# Altium schematic sheet KeyMatrix.SchDoc
size A3; SheetNumber: 2; SheetTotal: 2
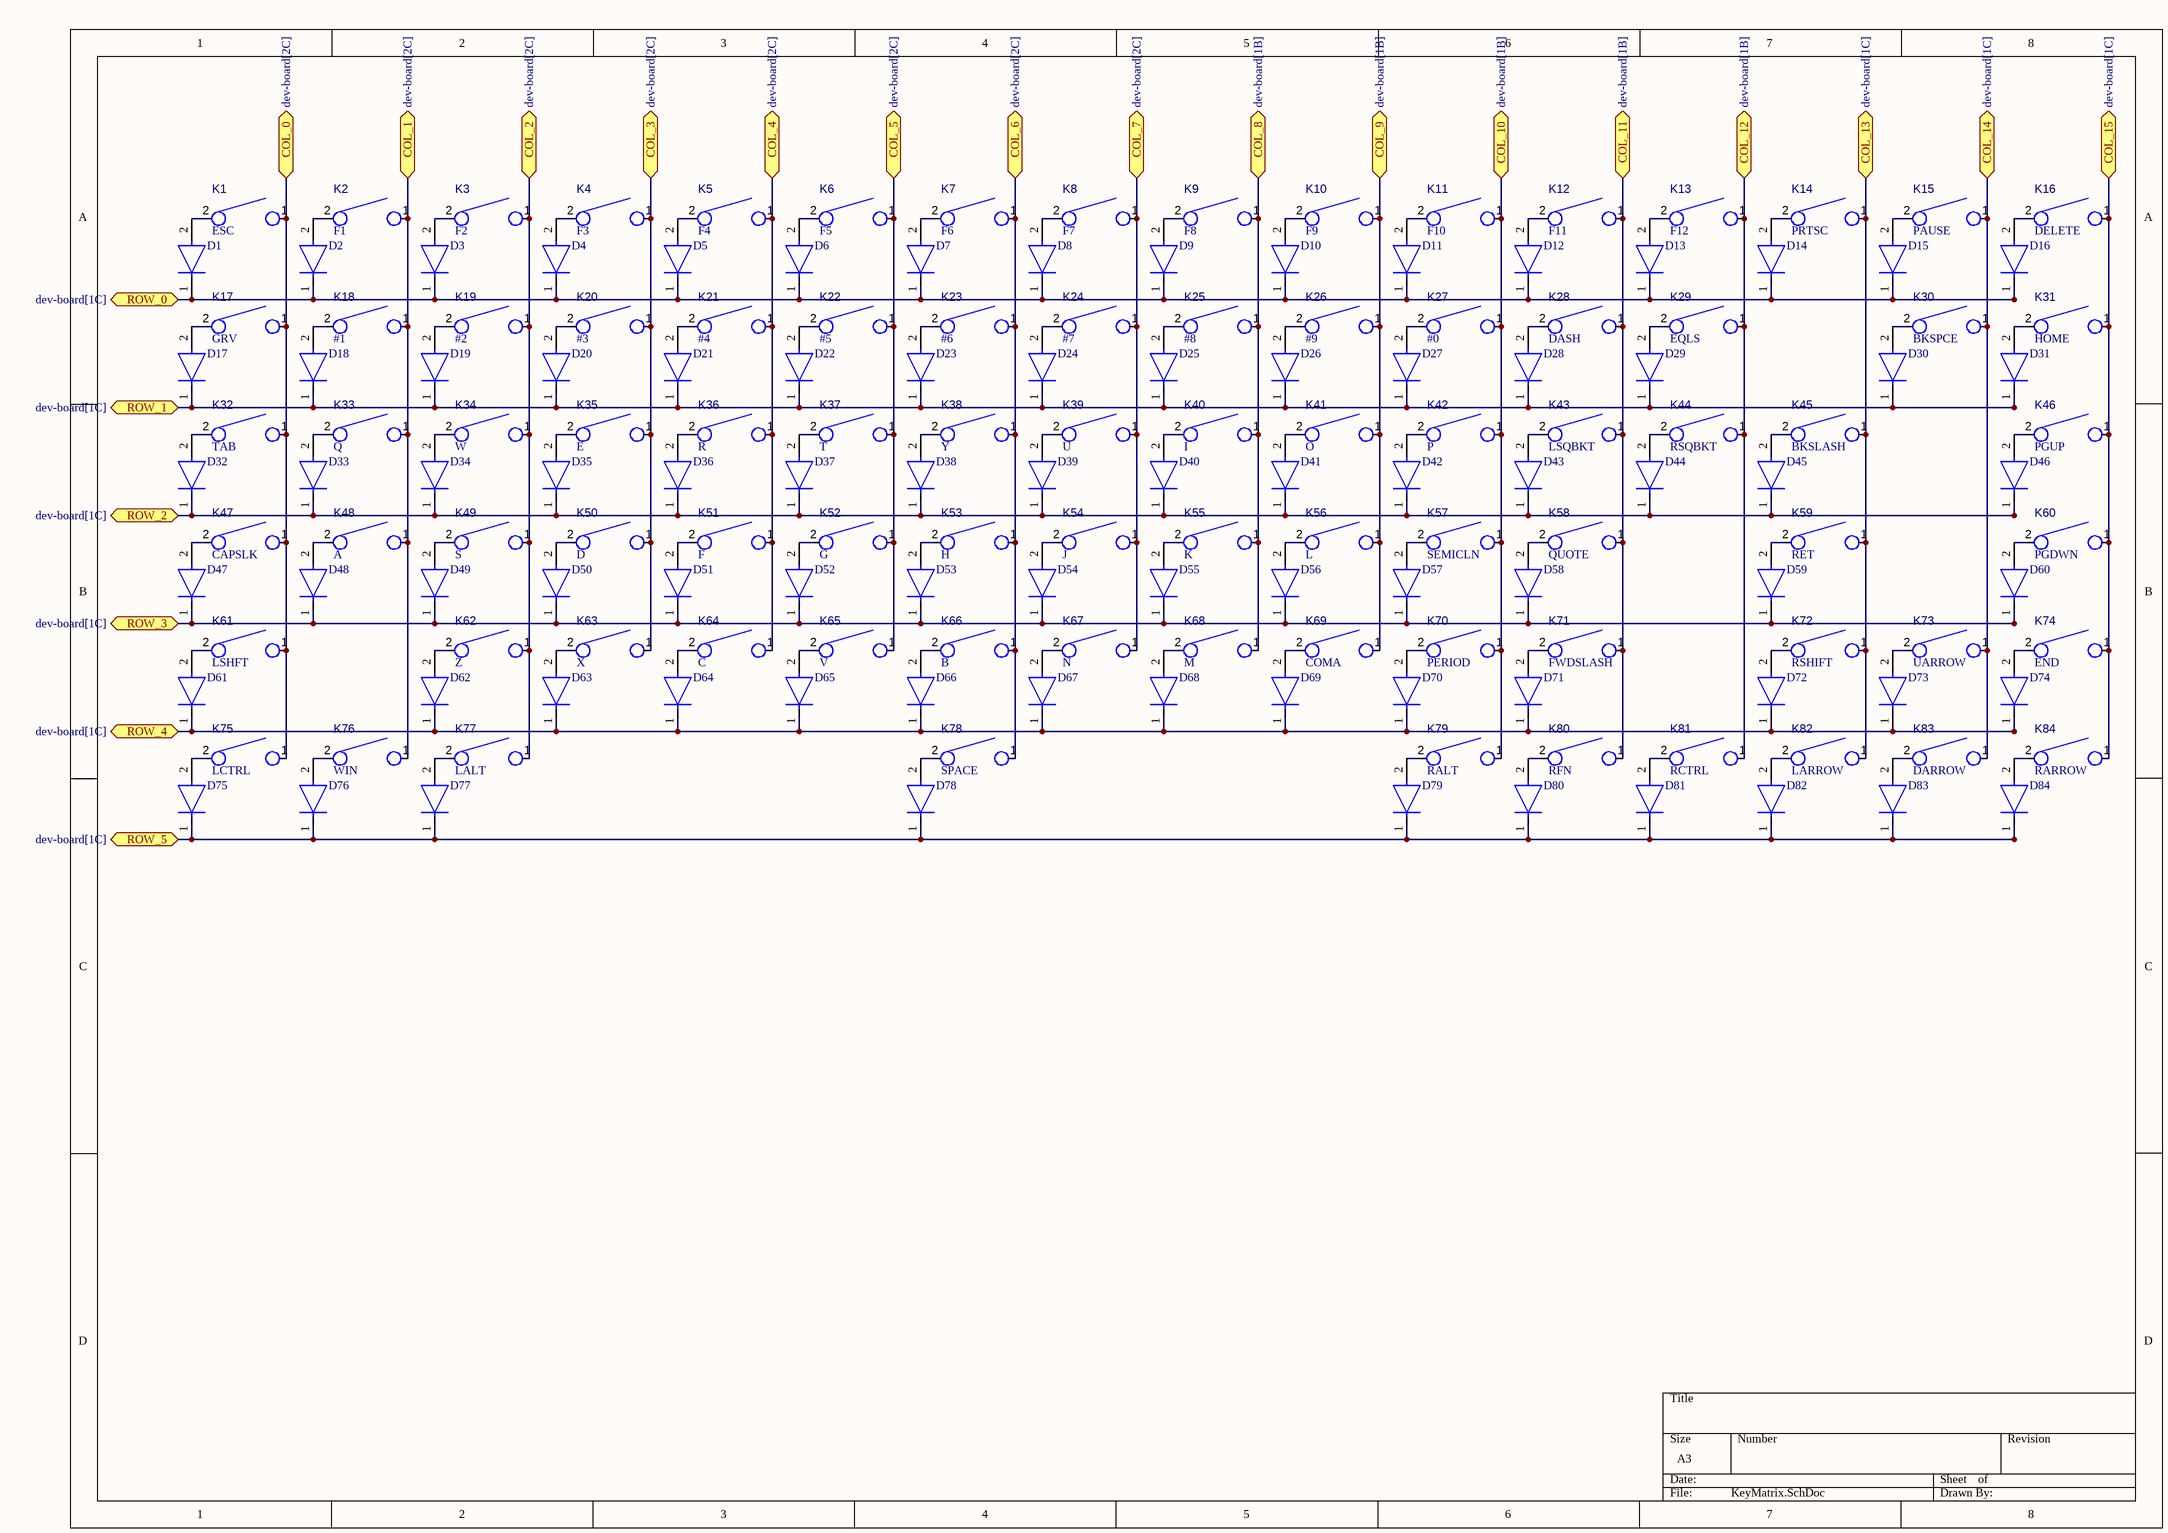
[diagram p0: KeyMatrix.SchDoc]

## Parts
D1  (no value)  [FP-SOD-123-IPC_A]
D2  (no value)  [FP-SOD-123-IPC_A]
D3  (no value)  [FP-SOD-123-IPC_A]
D4  (no value)  [FP-SOD-123-IPC_A]
D5  (no value)  [FP-SOD-123-IPC_A]
D6  (no value)  [FP-SOD-123-IPC_A]
D7  (no value)  [FP-SOD-123-IPC_A]
D8  (no value)  [FP-SOD-123-IPC_A]
D9  (no value)  [FP-SOD-123-IPC_A]
D10  (no value)  [FP-SOD-123-IPC_A]
D11  (no value)  [FP-SOD-123-IPC_A]
D12  (no value)  [FP-SOD-123-IPC_A]
D13  (no value)  [FP-SOD-123-IPC_A]
D14  (no value)  [FP-SOD-123-IPC_A]
D15  (no value)  [FP-SOD-123-IPC_A]
D16  (no value)  [FP-SOD-123-IPC_A]
D17  (no value)  [FP-SOD-123-IPC_A]
D18  (no value)  [FP-SOD-123-IPC_A]
D19  (no value)  [FP-SOD-123-IPC_A]
D20  (no value)  [FP-SOD-123-IPC_A]
D21  (no value)  [FP-SOD-123-IPC_A]
D22  (no value)  [FP-SOD-123-IPC_A]
D23  (no value)  [FP-SOD-123-IPC_A]
D24  (no value)  [FP-SOD-123-IPC_A]
D25  (no value)  [FP-SOD-123-IPC_A]
D26  (no value)  [FP-SOD-123-IPC_A]
D27  (no value)  [FP-SOD-123-IPC_A]
D28  (no value)  [FP-SOD-123-IPC_A]
D29  (no value)  [FP-SOD-123-IPC_A]
D30  (no value)  [FP-SOD-123-IPC_A]
D31  (no value)  [FP-SOD-123-IPC_A]
D32  (no value)  [FP-SOD-123-IPC_A]
D33  (no value)  [FP-SOD-123-IPC_A]
D34  (no value)  [FP-SOD-123-IPC_A]
D35  (no value)  [FP-SOD-123-IPC_A]
D36  (no value)  [FP-SOD-123-IPC_A]
D37  (no value)  [FP-SOD-123-IPC_A]
D38  (no value)  [FP-SOD-123-IPC_A]
D39  (no value)  [FP-SOD-123-IPC_A]
D40  (no value)  [FP-SOD-123-IPC_A]
D41  (no value)  [FP-SOD-123-IPC_A]
D42  (no value)  [FP-SOD-123-IPC_A]
D43  (no value)  [FP-SOD-123-IPC_A]
D44  (no value)  [FP-SOD-123-IPC_A]
D45  (no value)  [FP-SOD-123-IPC_A]
D46  (no value)  [FP-SOD-123-IPC_A]
D47  (no value)  [FP-SOD-123-IPC_A]
D48  (no value)  [FP-SOD-123-IPC_A]
D49  (no value)  [FP-SOD-123-IPC_A]
D50  (no value)  [FP-SOD-123-IPC_A]
D51  (no value)  [FP-SOD-123-IPC_A]
D52  (no value)  [FP-SOD-123-IPC_A]
D53  (no value)  [FP-SOD-123-IPC_A]
D54  (no value)  [FP-SOD-123-IPC_A]
D55  (no value)  [FP-SOD-123-IPC_A]
D56  (no value)  [FP-SOD-123-IPC_A]
D57  (no value)  [FP-SOD-123-IPC_A]
D58  (no value)  [FP-SOD-123-IPC_A]
D59  (no value)  [FP-SOD-123-IPC_A]
D60  (no value)  [FP-SOD-123-IPC_A]
D61  (no value)  [FP-SOD-123-IPC_A]
D62  (no value)  [FP-SOD-123-IPC_A]
D63  (no value)  [FP-SOD-123-IPC_A]
D64  (no value)  [FP-SOD-123-IPC_A]
D65  (no value)  [FP-SOD-123-IPC_A]
D66  (no value)  [FP-SOD-123-IPC_A]
D67  (no value)  [FP-SOD-123-IPC_A]
D68  (no value)  [FP-SOD-123-IPC_A]
D69  (no value)  [FP-SOD-123-IPC_A]
D70  (no value)  [FP-SOD-123-IPC_A]
D71  (no value)  [FP-SOD-123-IPC_A]
D72  (no value)  [FP-SOD-123-IPC_A]
D73  (no value)  [FP-SOD-123-IPC_A]
D74  (no value)  [FP-SOD-123-IPC_A]
D75  (no value)  [FP-SOD-123-IPC_A]
D76  (no value)  [FP-SOD-123-IPC_A]
D77  (no value)  [FP-SOD-123-IPC_A]
D78  (no value)  [FP-SOD-123-IPC_A]
D79  (no value)  [FP-SOD-123-IPC_A]
D80  (no value)  [FP-SOD-123-IPC_A]
D81  (no value)  [FP-SOD-123-IPC_A]
D82  (no value)  [FP-SOD-123-IPC_A]
D83  (no value)  [FP-SOD-123-IPC_A]
D84  (no value)  [FP-SOD-123-IPC_A]
K1  ESC  [Mx_Alps_100]
K2  F1  [Mx_Alps_100]
K3  F2  [Mx_Alps_100]
K4  F3  [Mx_Alps_100]
K5  F4  [Mx_Alps_100]
K6  F5  [Mx_Alps_100]
K7  F6  [Mx_Alps_100]
K8  F7  [Mx_Alps_100]
K9  F8  [Mx_Alps_100]
K10  F9  [Mx_Alps_100]
K11  F10  [Mx_Alps_100]
K12  F11  [Mx_Alps_100]
K13  F12  [Mx_Alps_100]
K14  PRTSC  [Mx_Alps_100]
K15  PAUSE  [Mx_Alps_100]
K16  DELETE  [Mx_Alps_100]
K17  GRV  [Mx_Alps_100]
K18  #1  [Mx_Alps_100]
K19  #2  [Mx_Alps_100]
K20  #3  [Mx_Alps_100]
K21  #4  [Mx_Alps_100]
K22  #5  [Mx_Alps_100]
K23  #6  [Mx_Alps_100]
K24  #7  [Mx_Alps_100]
K25  #8  [Mx_Alps_100]
K26  #9  [Mx_Alps_100]
K27  #0  [Mx_Alps_100]
K28  DASH  [Mx_Alps_100]
K29  EQLS  [Mx_Alps_100]
K30  BKSPCE  [Mx_Alps_200]
K31  HOME  [Mx_Alps_100]
K32  TAB  [Mx_Alps_150]
K33  Q  [Mx_Alps_100]
K34  W  [Mx_Alps_100]
K35  E  [Mx_Alps_100]
K36  R  [Mx_Alps_100]
K37  T  [Mx_Alps_100]
K38  Y  [Mx_Alps_100]
K39  U  [Mx_Alps_100]
K40  I  [Mx_Alps_100]
K41  O  [Mx_Alps_100]
K42  P  [Mx_Alps_100]
K43  LSQBKT  [Mx_Alps_100]
K44  RSQBKT  [Mx_Alps_100]
K45  BKSLASH  [Mx_Alps_150]
K46  PGUP  [Mx_Alps_100]
K47  CAPSLK  [Mx_Alps_175]
K48  A  [Mx_Alps_100]
K49  S  [Mx_Alps_100]
K50  D  [Mx_Alps_100]
K51  F  [Mx_Alps_100]
K52  G  [Mx_Alps_100]
K53  H  [Mx_Alps_100]
K54  J  [Mx_Alps_100]
K55  K  [Mx_Alps_100]
K56  L  [Mx_Alps_100]
K57  SEMICLN  [Mx_Alps_100]
K58  QUOTE  [Mx_Alps_100]
K59  RET  [Mx_Alps_225]
K60  PGDWN  [Mx_Alps_100]
K61  LSHFT  [Mx_Alps_225]
K62  Z  [Mx_Alps_100]
K63  X  [Mx_Alps_100]
K64  C  [Mx_Alps_100]
K65  V  [Mx_Alps_100]
K66  B  [Mx_Alps_100]
K67  N  [Mx_Alps_100]
K68  M  [Mx_Alps_100]
K69  COMA  [Mx_Alps_100]
K70  PERIOD  [Mx_Alps_100]
K71  FWDSLASH  [Mx_Alps_100]
K72  RSHIFT  [Mx_Alps_175]
K73  UARROW  [Mx_Alps_100]
K74  END  [Mx_Alps_100]
K75  LCTRL  [Mx_Alps_125]
K76  WIN  [Mx_Alps_125]
K77  LALT  [Mx_Alps_125]
K78  SPACE  [Mx_Alps_625]
K79  RALT  [Mx_Alps_100]
K80  RFN  [Mx_Alps_100]
K81  RCTRL  [Mx_Alps_100]
K82  LARROW  [Mx_Alps_100]
K83  DARROW  [Mx_Alps_100]
K84  RARROW  [Mx_Alps_100]

## Ports
COL_0 (bidir, see dev-board[2C]), COL_1 (bidir, see dev-board[2C]), COL_2 (bidir, see dev-board[2C]), COL_3 (bidir, see dev-board[2C]), COL_4 (bidir, see dev-board[2C]), COL_5 (bidir, see dev-board[2C]), COL_6 (bidir, see dev-board[2C]), COL_7 (bidir, see dev-board[2C]), COL_8 (bidir, see dev-board[1B]), COL_9 (bidir, see dev-board[1B]), COL_10 (bidir, see dev-board[1B]), COL_11 (bidir, see dev-board[1B]), COL_12 (bidir, see dev-board[1B]), COL_13 (bidir, see dev-board[1C]), COL_14 (bidir, see dev-board[1C]), COL_15 (bidir, see dev-board[1C]), ROW_0 (bidir, see dev-board[1C]), ROW_1 (bidir, see dev-board[1C]), ROW_2 (bidir, see dev-board[1C]), ROW_3 (bidir, see dev-board[1C]), ROW_4 (bidir, see dev-board[1C]), ROW_5 (bidir, see dev-board[1C])

## Nets
COL_0: K1.1 K17.1 K32.1 K47.1 K61.1 K75.1 ; port COL_0
COL_1: K2.1 K18.1 K33.1 K48.1 K76.1 ; port COL_1
COL_2: K3.1 K19.1 K34.1 K49.1 K62.1 K77.1 ; port COL_2
COL_3: K4.1 K20.1 K35.1 K50.1 K63.1 ; port COL_3
COL_4: K5.1 K21.1 K36.1 K51.1 K64.1 ; port COL_4
COL_5: K6.1 K22.1 K37.1 K52.1 K65.1 ; port COL_5
COL_6: K7.1 K23.1 K38.1 K53.1 K66.1 K78.1 ; port COL_6
COL_7: K8.1 K24.1 K39.1 K54.1 K67.1 ; port COL_7
COL_8: K9.1 K25.1 K40.1 K55.1 K68.1 ; port COL_8
COL_9: K10.1 K26.1 K41.1 K56.1 K69.1 ; port COL_9
COL_10: K11.1 K27.1 K42.1 K57.1 K70.1 K79.1 ; port COL_10
COL_11: K12.1 K28.1 K43.1 K58.1 K71.1 K80.1 ; port COL_11
COL_12: K13.1 K29.1 K44.1 K81.1 ; port COL_12
COL_13: K14.1 K45.1 K59.1 K72.1 K82.1 ; port COL_13
COL_14: K15.1 K30.1 K73.1 K83.1 ; port COL_14
COL_15: K16.1 K31.1 K46.1 K60.1 K74.1 K84.1 ; port COL_15
ROW_0: D1.1(C) D2.1(C) D3.1(C) D4.1(C) D5.1(C) D6.1(C) D7.1(C) D8.1(C) D9.1(C) D10.1(C) D11.1(C) D12.1(C) D13.1(C) D14.1(C) D15.1(C) D16.1(C) ; port ROW_0
ROW_1: D17.1(C) D18.1(C) D19.1(C) D20.1(C) D21.1(C) D22.1(C) D23.1(C) D24.1(C) D25.1(C) D26.1(C) D27.1(C) D28.1(C) D29.1(C) D30.1(C) D31.1(C) ; port ROW_1
ROW_2: D32.1(C) D33.1(C) D34.1(C) D35.1(C) D36.1(C) D37.1(C) D38.1(C) D39.1(C) D40.1(C) D41.1(C) D42.1(C) D43.1(C) D44.1(C) D45.1(C) D46.1(C) ; port ROW_2
ROW_3: D47.1(C) D48.1(C) D49.1(C) D50.1(C) D51.1(C) D52.1(C) D53.1(C) D54.1(C) D55.1(C) D56.1(C) D57.1(C) D58.1(C) D59.1(C) D60.1(C) ; port ROW_3
ROW_4: D61.1(C) D62.1(C) D63.1(C) D64.1(C) D65.1(C) D66.1(C) D67.1(C) D68.1(C) D69.1(C) D70.1(C) D71.1(C) D72.1(C) D73.1(C) D74.1(C) ; port ROW_4
ROW_5: D75.1(C) D76.1(C) D77.1(C) D78.1(C) D79.1(C) D80.1(C) D81.1(C) D82.1(C) D83.1(C) D84.1(C) ; port ROW_5
NetD1_2: D1.2(A) K1.2
NetD2_2: D2.2(A) K2.2
NetD3_2: D3.2(A) K3.2
NetD4_2: D4.2(A) K4.2
NetD5_2: D5.2(A) K5.2
NetD6_2: D6.2(A) K6.2
NetD7_2: D7.2(A) K7.2
NetD8_2: D8.2(A) K8.2
NetD9_2: D9.2(A) K9.2
NetD10_2: D10.2(A) K10.2
NetD11_2: D11.2(A) K11.2
NetD12_2: D12.2(A) K12.2
NetD13_2: D13.2(A) K13.2
NetD14_2: D14.2(A) K14.2
NetD15_2: D15.2(A) K15.2
NetD16_2: D16.2(A) K16.2
NetD17_2: D17.2(A) K17.2
NetD18_2: D18.2(A) K18.2
NetD19_2: D19.2(A) K19.2
NetD20_2: D20.2(A) K20.2
NetD21_2: D21.2(A) K21.2
NetD22_2: D22.2(A) K22.2
NetD23_2: D23.2(A) K23.2
NetD24_2: D24.2(A) K24.2
NetD25_2: D25.2(A) K25.2
NetD26_2: D26.2(A) K26.2
NetD27_2: D27.2(A) K27.2
NetD28_2: D28.2(A) K28.2
NetD29_2: D29.2(A) K29.2
NetD30_2: D30.2(A) K30.2
NetD31_2: D31.2(A) K31.2
NetD32_2: D32.2(A) K32.2
NetD33_2: D33.2(A) K33.2
NetD34_2: D34.2(A) K34.2
NetD35_2: D35.2(A) K35.2
NetD36_2: D36.2(A) K36.2
NetD37_2: D37.2(A) K37.2
NetD38_2: D38.2(A) K38.2
NetD39_2: D39.2(A) K39.2
NetD40_2: D40.2(A) K40.2
NetD41_2: D41.2(A) K41.2
NetD42_2: D42.2(A) K42.2
NetD43_2: D43.2(A) K43.2
NetD44_2: D44.2(A) K44.2
NetD45_2: D45.2(A) K45.2
NetD46_2: D46.2(A) K46.2
NetD47_2: D47.2(A) K47.2
NetD48_2: D48.2(A) K48.2
NetD49_2: D49.2(A) K49.2
NetD50_2: D50.2(A) K50.2
NetD51_2: D51.2(A) K51.2
NetD52_2: D52.2(A) K52.2
NetD53_2: D53.2(A) K53.2
NetD54_2: D54.2(A) K54.2
NetD55_2: D55.2(A) K55.2
NetD56_2: D56.2(A) K56.2
NetD57_2: D57.2(A) K57.2
NetD58_2: D58.2(A) K58.2
NetD59_2: D59.2(A) K59.2
NetD60_2: D60.2(A) K60.2
NetD61_2: D61.2(A) K61.2
NetD62_2: D62.2(A) K62.2
NetD63_2: D63.2(A) K63.2
NetD64_2: D64.2(A) K64.2
NetD65_2: D65.2(A) K65.2
NetD66_2: D66.2(A) K66.2
NetD67_2: D67.2(A) K67.2
NetD68_2: D68.2(A) K68.2
NetD69_2: D69.2(A) K69.2
NetD70_2: D70.2(A) K70.2
NetD71_2: D71.2(A) K71.2
NetD72_2: D72.2(A) K72.2
NetD73_2: D73.2(A) K73.2
NetD74_2: D74.2(A) K74.2
NetD75_2: D75.2(A) K75.2
NetD76_2: D76.2(A) K76.2
NetD77_2: D77.2(A) K77.2
NetD78_2: D78.2(A) K78.2
NetD79_2: D79.2(A) K79.2
NetD80_2: D80.2(A) K80.2
NetD81_2: D81.2(A) K81.2
NetD82_2: D82.2(A) K82.2
NetD83_2: D83.2(A) K83.2
NetD84_2: D84.2(A) K84.2

## Library data of the parts
D1-D84 = CMP-2000-04993-2: DIODE GEN PURP 100V 150MA SOD123; Max Reverse Leakage Current: 5uA; Max Surge Current: 2A; Reverse Recovery Time: 4ns; Polarity: Standard; Capacitance: 4pF; Max Forward Surge Current (Ifsm): 1A; Element Configuration: Single; Power Dissipation: 400mW; Forward Voltage: 1V; Radiation Hardening: No; Lead Free: Lead Free; Max Reverse Voltage (DC): 100V; Current Rating: 150mA; Forward Current: 150mA; Packaging: Tape and Reel; Number of Pins: 2; Package Quantity: 3000; Max Operating Temperature: 150°C; Min Operating Temperature: -65°C; Average Rectified Current: 150mA; Recovery Time: 4ns; Output Current: 150mA; Peak Non-Repetitive Surge Current: 2A; Width: 1.8mm; Voltage Rating (DC): 100V; Height: 1.2mm; Max Repetitive Reverse Voltage (Vrrm): 100V; Mount: Surface Mount; Length: 2.85mm
K1-K84 = CMP-006-000013-2: Value: KEYSW; Design Item ID: KEYSW; Source: keyboard_parts.SchLib